# EasyEDA Pro project V0.2-Umbilical-ADXL-2.epro

# Board PCB3
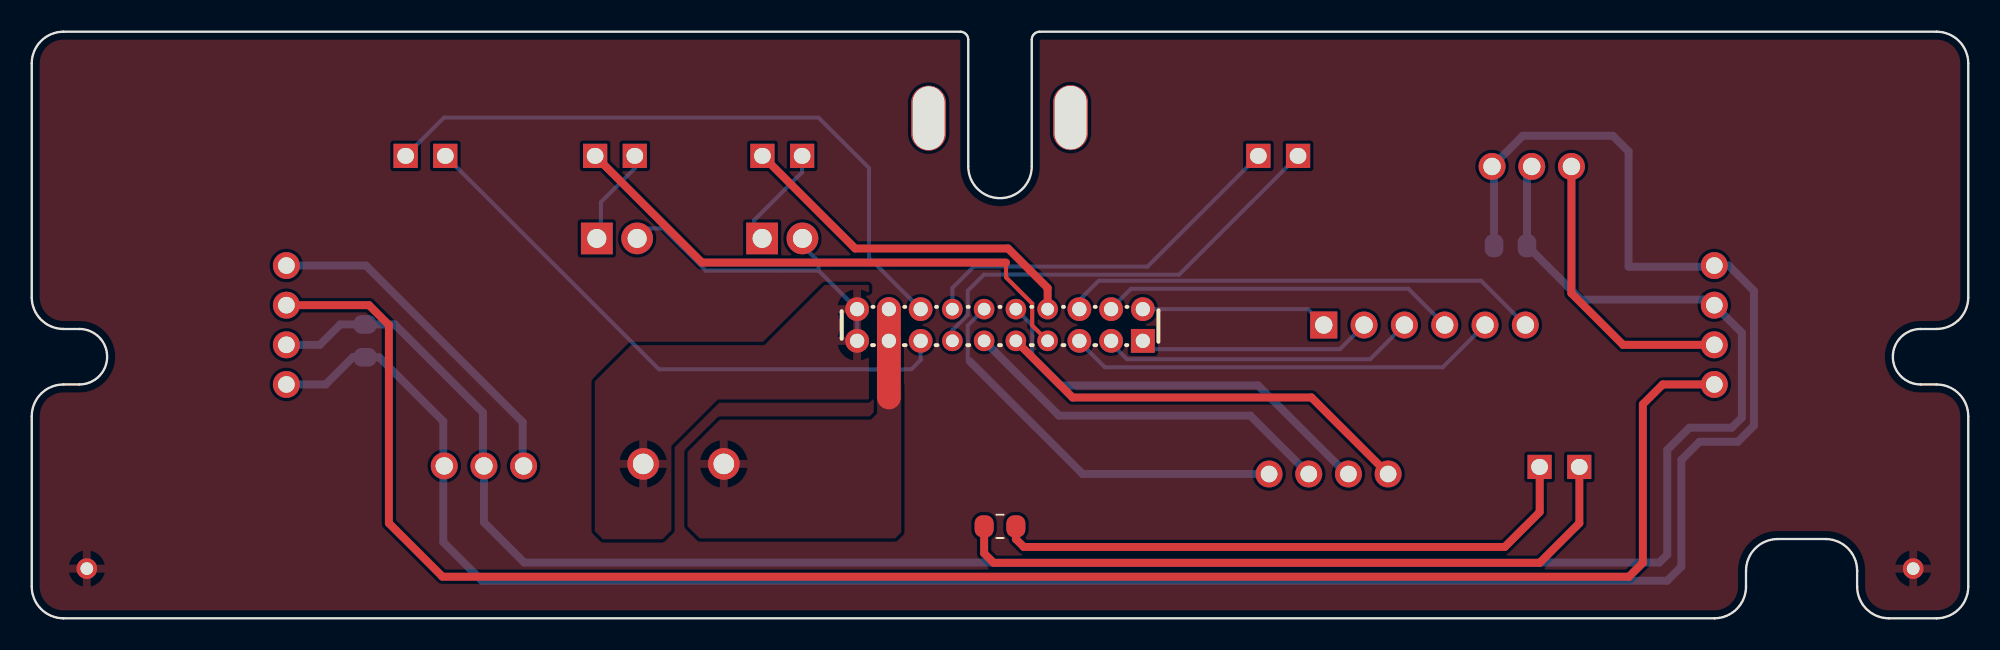
[diagram p0: board, top side]
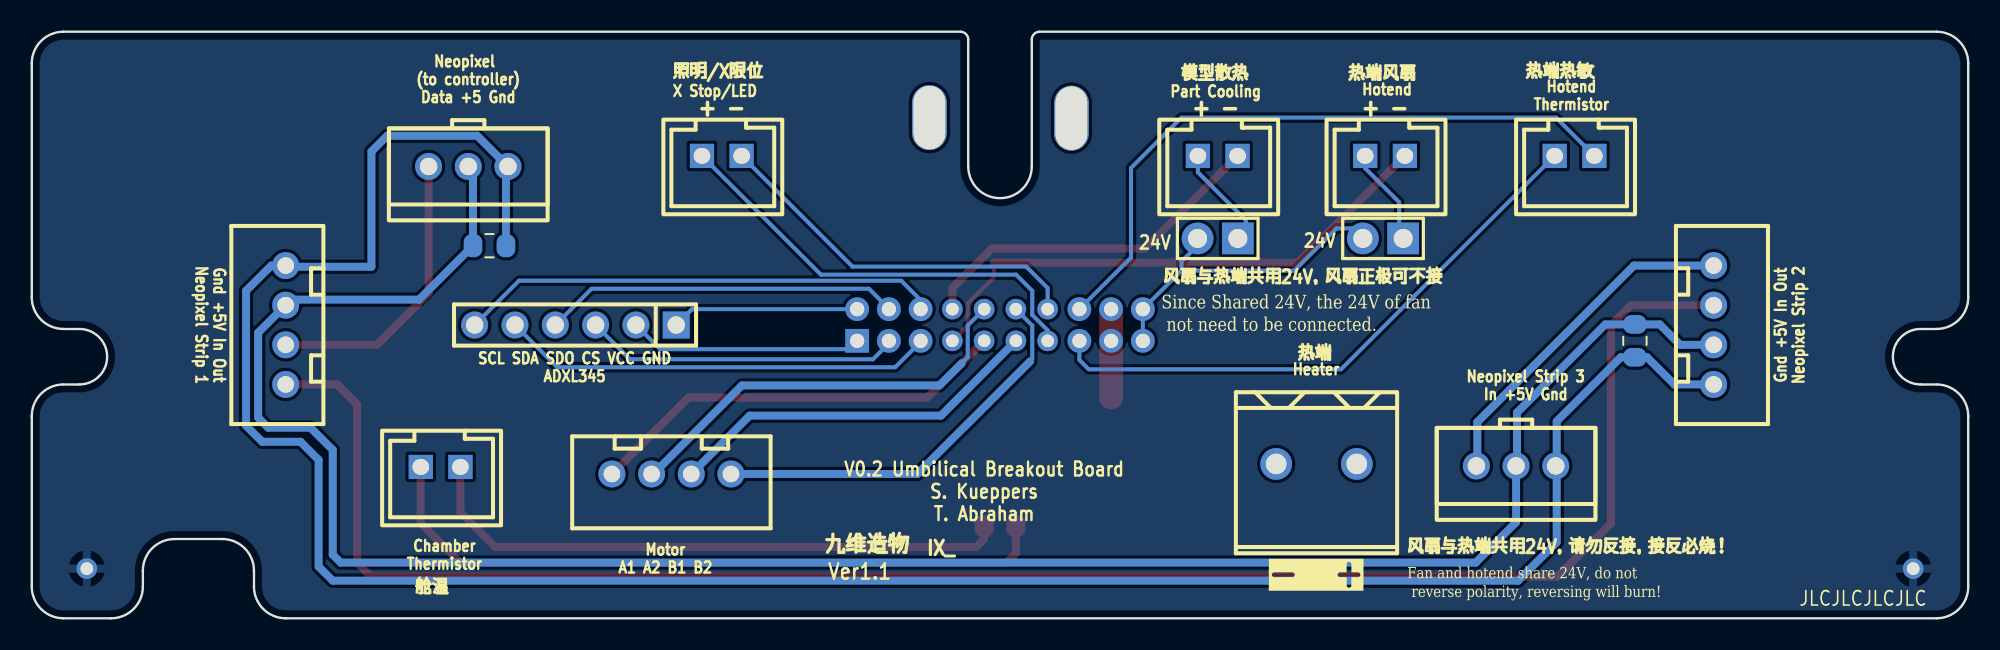
[diagram p1: board, bottom side, seen from below]

Outline 122 x 37 mm; copper layers: Top Layer, Bottom Layer. Coordinates in mm from the lower left corner of the outline.
Outline path: 0,35 0,20.25 arc(0.59,18.84) 2,18.25 3,18.25 arc(4.75,16.5) 3,14.75 2,14.75 arc(0.59,14.16) 0,12.75 0,2 arc(0.59,0.59) 2,0 106,0 arc(107.41,0.59) 108,2 108,3 arc(108.59,4.41) 110,5 113,5 arc(114.41,4.41) 115,3 115,2 arc(115.59,0.59) 117,0 120,0 arc(121.41,0.59) 122,2 122,12.75 arc(121.41,14.16) 120,14.75 119,14.75 arc(117.25,16.5) 119,18.25 120,18.25 arc(121.41,18.84) 122,20.25 122,35 arc(121.41,36.41) 120,37 63.5,37 arc(63.15,36.85) 63,36.5 63,28.5 arc(61,26.5) 59,28.5 59,36.5 arc(58.85,36.85) 58.5,37 2,37 arc(0.59,36.41) 0,35
Stack: Top Layer 0.035mm / Dielectric1 1.51mm FR4 er 4.5 / Bottom Layer 0.035mm

## Design rules (mm)
template: 自定义配置
spacing copperThickness1oz (default): track to track 0.102, other pairs 0.152 to 0.3
spacing copperThickness2oz: track to track 0.203, other pairs 0.152 to 0.3
track width copperThickness1oz (default): min 0.127, default 0.254, max 2.54
track width copperThickness2oz: min 0.203, default 0.254, max 2.54
differential pair differentialPair (default): width min 0.127, default 0.254, max 2.54; gap min 0.152, default 0.152
via viaSize (default): diameter min 0.5, default 0.61, max 10; hole min 0.3, default 0.305, max 6.3

## Placement (name value [footprint] x y rotation side)
C2  C  [Capacitor_SMD:C_0805_2012Metric_Pad1.18x1.45mm_HandSolder]  93.16 23.5 180 bottom
C3  C  [Capacitor_SMD:C_0805_2012Metric_Pad1.18x1.45mm_HandSolder]  21 17.5 270 bottom
CN1  M2026R-2x10P  [CONN-TH_10P-M2026R-2-10P]  61 18.5 0 top
CN2  HC-XHB-3A  [CONN-TH_3P-P2.50_HC-XHB-3A]  94.5 28.5 0 bottom
CN3  HC-XHB-3A  [CONN-TH_3P-P2.50_HC-XHB-3A]  28.49 9.61 0 bottom
H1  PZ254V-11-06P  [HDR-TH_6P-P2.54-V-M]  87.75 18.5 0 bottom
H2  PZ254V-11-02P  [HDR-TH_2P-P2.54-V-M]  47.28 23.96 0 bottom
H3  PZ254V-11-02P  [HDR-TH_2P-P2.54-V-M]  36.87 23.96 0 bottom
Heater  WJ500V-5.08-2P  [CONN-TH_2P-P5.00_WJ500V-5.08-2P]  41.06 9.74 0 bottom
HEF  XH2.54直插座-2P  [CONN-TH_XH2.54-2P]  36.74 29.17 0 bottom
LED  -  [CONN-TH_XH2.54-2P]  78.53 29.17 0 bottom
LED#2  -  [CONN-TH_XH2.54-2P]  96.24 9.55 0 bottom
Motor  -  [CONN-TH_4P-P2.50-XH2.54-4P]  81.7 9.1 180 bottom
Motor#2  -  [CONN-TH_4P-P2.50-XH2.54-4P]  106 18.5 270 bottom
Motor#3  -  [CONN-TH_4P-P2.50-XH2.54-4P]  16.04 18.5 90 bottom
NOREF  -  [Pad_e8]  65.44 31.58 0 top
NOREF#2  -  [Pad_e398]  3.47 3.13 0 top
NOREF#3  -  [Pad_e5]  56.5 31.55 0 top
NOREF#4  -  [Pad_e363]  118.53 3.13 0 top
PCF  XH2.54直插座-2P  [CONN-TH_XH2.54-2P]  47.28 29.17 0 bottom
TH0  XH2.54直插座-2P  [CONN-TH_XH2.54-2P]  24.81 29.17 0 bottom
TH1  100nF  [Resistor_SMD:R_0805_2012Metric_Pad1.20x1.40mm_HandSolder]  61 5.8 0 top

## Footprints (pads in the part's own frame, mm; a bottom-side part is the same pattern mirrored in y, then rotated)
Capacitor_SMD:C_0805_2012Metric_Pad1.18x1.45mm_HandSolder
  rrect 1.175x1.45 smd: 1(-1.038,0) 2(1.038,0)
CONN-TH_2P-P5.00_WJ500V-5.08-2P
  round 2 hole 1.3: 1(-2.54,0) 2(2.54,0)
CONN-TH_3P-P2.50_HC-XHB-3A
  round 1.7 hole 1.1: 1(-2.5,0) 2(0,0) 3(2.5,0)
CONN-TH_4P-P2.50-XH2.54-4P
  round 1.7 hole 1.05: 1(3.75,0) 2(1.25,0) 3(-1.25,0) 4(-3.75,0)
CONN-TH_10P-M2026R-2-10P
  rect 1.5x1.5 hole 0.9: 1(9,-1)
  round 1.5 hole 0.9: 2(9,1) 3(7,-1) 4(7,1) 5(5,-1) 6(5,1) 15(-5,-1) 16(-5,1) 17(-7,-1) 18(-7,1) 19(-9,-1) 20(-9,1)
  round 1.3 hole 0.8: 7(3,-1) 8(3,1) 9(1,-1) 10(1,1) 11(-1,-1) 12(-1,1) 13(-3,-1) 14(-3,1)
CONN-TH_XH2.54-2P
  rect 1.524x1.524 hole 1.05x1: 1(-1.25,0) 2(1.25,0)
HDR-TH_2P-P2.54-V-M
  rect 2x2 hole 1.2: 1(-1.27,0)
  round 2 hole 1.2: 2(1.27,0)
HDR-TH_6P-P2.54-V-M
  rect 1.7x1.7 hole 1.1: 1(-6.35,0)
  round 1.7 hole 1.1: 2(-3.81,0) 3(-1.27,0) 4(1.27,0) 5(3.81,0) 6(6.35,0)
Pad_e5
  oval 2.2x4.1 hole 2x4: 1(0,0)
Pad_e8
  oval 2.2x4.1 hole 2x4: 1(0,0)
Pad_e363
  round 1.3 hole 0.8: 21(0,0)
Pad_e398
  round 1.3 hole 0.8: 21(0,0)
Resistor_SMD:R_0805_2012Metric_Pad1.20x1.40mm_HandSolder
  rrect 1.2x1.4 smd: 1(-1,0) 2(1,0)

## Nets
5V: C2.1 C3.1 Motor#2.3 Motor#3.3
24V: CN1.19 CN1.20 H2.2 H3.2 Heater.1
+5V: CN1.1 H1.2
GND: CN1.2 H1.1
1: NOREF#2.21 NOREF#4.21
A1: CN1.9 Motor.4
A2: CN1.10 Motor.3
B1: CN1.11 Motor.2
B2: CN1.12 Motor.1
CS: CN1.3 H1.3
DATA: Motor#2.2
DATAIN2: Motor#2.1 Motor#3.2
DATAOUT2: Motor#3.1
GROUND: C2.2 C3.2 Motor#2.4 Motor#3.4
HE-: CN1.17 CN1.18 Heater.2
HEF-: CN1.7 HEF.1
LED+: CN1.13 LED.2
LED-: CN1.14 LED.1
NET-(J8-PAD1): LED#2.2 TH1.1
NET-(J8-PAD2): LED#2.1 TH1.2
PCF-: CN1.8 PCF.1
SCL: CN1.6 H1.6
SDA: CN1.5 H1.5
SDO: CN1.4 H1.4
TH0+: CN1.16 TH0.1
TH0-: CN1.15 TH0.2
$1N510: H2.1 PCF.2
$1N512: H3.1 HEF.2

Pads without a net: CN2 1 2 3; CN3 1 2 3; NOREF 1; NOREF#3 1

## Routing (per net, layer and track width the routed paths; a pad name or vN(x,y) marks a point on that pad's centre or on a via; arc(x,y) is an arc through that point)
5V: length 136.5
  Bottom Layer w0.5: 16,17.25 18.15,17.25 19.44,18.54 C3.1 22.86,18.54 28.43,12.97 28.43,9.61 28.49,9.55 28.49,6.05 31.03,3.51 102.54,3.51 103.04,4.01 103.04,10.63 104.43,12.02 107.1,12.02 107.74,12.66 107.74,18.01 105.65,20.1 97.6,20.1 C2.1 94.2,28.2 94.5,28.5
24V: length 20.6
  Bottom Layer w0.254: 47.97,24.1 49.57,22.5 49.57,21.93 ; 38.3,24.6 39.79,24.6 42.46,21.93 49.57,21.93 ; CN1.19 CN1.20 49.57,21.93
+5V: length 14.8
  Bottom Layer w0.254: H1.2 82.41,16.98 70.52,16.98 CN1.1
GND: length 11.8
  Bottom Layer w0.254: 81.4,18.5 80.4,19.5 CN1.2
A1: length 26.9
  Top Layer w0.5: CN1.9 65.57,13.93 80.62,13.93 Motor.4
A2: length 26.4
  Bottom Layer w0.254: 63.41,16.09 63.03,16.47 63.03,18.47 CN1.10
  Bottom Layer w0.5: Motor.3 82.84,9.1 77.26,14.69 64.81,14.69 63.41,16.09
B1: length 23.9
  Bottom Layer w0.5: Motor.2 76.77,12.79 64.72,12.79 CN1.11
B2: length 25.6
  Bottom Layer w0.254: CN1.12 58.97,18.47 58.97,16.34 59.09,16.21
  Bottom Layer w0.5: 59.09,16.21 66.21,9.1 Motor.1
CS: length 19.9
  Bottom Layer w0.254: CN1.3 68,17.34 69,16.34 84.32,16.34 H1.3
DATA: length 18.3
  Top Layer w0.5: 97,28.5 97,20.5 100.25,17.25 106,17.25
DATAIN2: length 115.3
  Top Layer w0.5: 106,14.75 102.75,14.75 101.5,13.5 101.5,3.5 100.62,2.63 25.88,2.63 22.5,6 22.5,18.5 21.25,19.75 16,19.75
DATAOUT2: length 21.8
  Bottom Layer w0.5: 16,22.25 21.06,22.25 30.93,12.38 30.93,9.61
GROUND: length 150.7
  Bottom Layer w0.5: C2.2 92.12,28.38 92,28.5 93.94,30.44 99.61,30.44 100.6,29.45 100.6,22.18 105.93,22.18 106,22.25 106.91,22.25 108.5,20.66 108.5,12.15 107.48,11.13 105.07,11.13 103.93,9.99 103.93,3.26 103.04,2.37 28.36,2.37 25.93,4.8 25.93,12.42 21.89,16.46 C3.2 20.23,16.46 18.52,14.75 16,14.75
HE-: length 5.6
  Top Layer w1.5: CN1.18 CN1.17 54,13.93
HEF-: length 34.7
  Top Layer w0.254: CN1.7 63.03,18.47 63.03,19.85 61.38,21.5 61.38,22.44
  Top Layer w0.5: 61.38,22.44 42.22,22.44 HEF.1
LED+: length 27.9
  Bottom Layer w0.254: CN1.13 58,18.17 58.97,19.14 58.97,20.66 59.98,21.68 72.28,21.68 LED.2
LED-: length 24.1
  Bottom Layer w0.254: LED.1 70.29,22.18 59.35,22.18 58,20.83 CN1.14
NET-(J8-PAD1): length 44
  Top Layer w0.5: TH1.1 60,4.1 60.6,3.5 95,3.5 97.5,6 97.5,9.5
NET-(J8-PAD2): length 37.7
  Top Layer w0.5: TH1.2 62,5 62.5,4.5 92.8,4.5 95,6.7 95,9.5
PCF-: length 22.8
  Top Layer w0.5: PCF.1 51.88,23.33 61.51,23.33 64,20.83 CN1.8
SCL: length 30.3
  Bottom Layer w0.254: H1.6 91.3,21.29 67.22,21.29 66,20.07 CN1.6
SDA: length 27.4
  Bottom Layer w0.254: CN1.5 66,17.44 67.6,15.83 88.89,15.83 91.56,18.5
SDO: length 22.5
  Bottom Layer w0.254: CN1.4 68,19.53 69.25,20.79 86.73,20.79 89.02,18.5
TH0+: length 41.8
  Bottom Layer w0.254: CN1.16 52.75,22.76 52.75,28.41 49.57,31.58 25.97,31.58 TH0.1
TH0-: length 37
  Bottom Layer w0.254: CN1.15 56,16.29 55.41,15.71 39.52,15.71 TH0.2
$1N510: length 6.1
  Bottom Layer w0.254: 45.35,24.34 45.51,24.5 45.51,25.1 48.53,28.13 PCF.2
$1N512: length 6
  Bottom Layer w0.254: HEF.2 37.99,28.39 35.85,26.25 35.85,24.37 36.08,24.6

## Copper pours and planes (outline as drawn; the poured copper is in the pictures)
24V on Top Layer: 49.95,21.03 46.15,17.23 37.76,17.23 35.47,14.94 35.47,5.49 35.98,4.99 39.74,4.99 40.3,5.55 40.3,10.88 43.22,13.8 52.75,13.8 52.75,21.03
1 on Top Layer: -2.5,40.22 122.91,40.22 122.91,-3.47 -2.5,-3.47
1 on Bottom Layer: -2.25,40.47 124.12,40.47 124.12,-3.22 -2.25,-3.22
HE- on Top Layer: 53.25,14.02 53.25,12.91 52.87,12.53 43.35,12.53 41.31,10.5 41.31,5.8 42.08,5.04 54.4,5.04 54.78,5.42 54.78,14.75 53.82,14.75

## Text on the board
Bottom Silkscreen Layer: Gnd +5V In Out / Neopixel Strip 1 | Gnd +5V In Out / Neopixel Strip 2 | X Stop/LED | Hotend / Thermistor | Neopixel Strip 3 / In +5V Gnd | Hotend | Heater | Part Cooling | Motor / A1 A2 B1 B2 | Neopixel / (to controller) / Data +5 Gnd | Chamber / Thermistor | SCL SDA SDO CS VCC GND / ADXL345 | 24V | V0.2 Umbilical Breakout Board / S. Kueppers / T. Abraham | JLCJLCJLCJLC | IX_ | Ver1.1 | + - | +  - | Fan and hotend share 24V, do not / reverse polarity, reversing will burn! | 热端热敏 | 风扇与热端共用24V，请勿反接，接反必烧！ | 热端风扇 | 热端 | 模型散热 | 风扇与热端共用24V，风扇正极可不接 | Since Shared 24V, the 24V of fan / not need to be connected. | 照明/X限位 | 舱温 | 九维造物
